# EAGLE schematic sdr_cutoff (EAGLE 9.4.2)
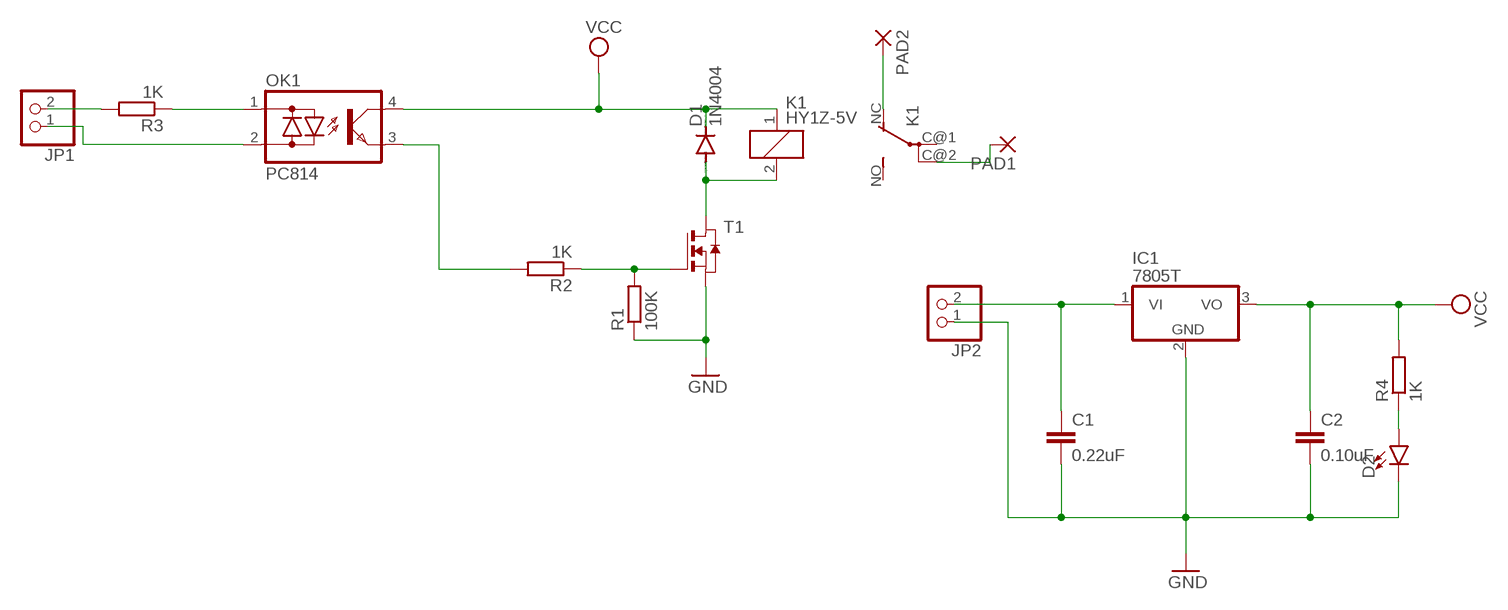
[diagram p0: schematic, sheet 1]

## Parts
C1  0.22uF  C-EU025-024X044  [C025-024X044]
C2  0.10uF  C-EU025-024X044  [C025-024X044]
D1  1N4004  [DO41-10]
D2  LED3MM  [LED_3MM]
IC1  7805T  [TO220H]
JP1  PINHD-1X2  [1X02]
JP2  PINHD-1X2  [1X02]
K1  HY1Z-5V  [HY]
OK1  PC814  [DIL04]
PAD1  2,54/0,8  [2,54/0,8]
PAD2  2,54/0,8  [2,54/0,8]
R1  100K  R-EU_0204/5  [0204/5]
R2  1K  R-EU_0204/5  [0204/5]
R3  1K  R-EU_0204/5  [0204/5]
R4  1K  R-EU_0204/5  [0204/5]
T1  NMOSE3L  [E3LINE]

## Nets
GND: C1.2 C2.2 D2.K(C) IC1.2(GND) JP2.1 R1.1 T1.3(S)
N$1: D1.A K1.2 T1.1(D)
N$2: OK1.3(E) R2.2
N$3: R1.2 R2.1 T1.2(G)
N$4: OK1.1(AC1) R3.1
N$5: JP1.1 OK1.2(AC2)
N$6: JP1.2 R3.2
N$8: C1.1 IC1.1(VI) JP2.2
N$9: K1.NC(2:O) PAD2.1(P)
N$10: D2.A R4.1
N$11: K1.C@2(2:P) PAD1.1(P)
VCC: C2.1 D1.C IC1.3(VO) K1.1 OK1.4(C) R4.2
Unconnected: K1.C@1(2:P) K1.NO(2:S)

## Library data of the parts
C1 C2 = rcl:C-EU: CAPACITOR, European symbol; SPICEPREFIX: C
D1 = diode:1N4004: DIODE general purpose rectifier, 1 A
D2 = SparkFun-LED:LED: LED (Generic) Standard schematic elements and footprints for 5mm, 3mm, 1206, and 0603 sized LEDs. Generic LEDs with no color specified.; PROD_ID: DIO-08794
IC1 = linear:78*: Positive VOLTAGE REGULATOR Source: http://cache.national.com/ds/LM/LM78L05.pdf http://www.fairchildsemi.com/ds/LM/LM7805.pdf
JP1 JP2 = pinhead:PINHD-1X2: PIN HEADER
K1 = relay:HY1*: Non-polarized 1 Form C Relay NAiS Source: http://www.mew-europe.com/.. en_ds_61012_0000.pdf; MF: AROMAT/ MATSUSHITA; MPN: HY1Z-5V; OC_FARNELL: unknown; OC_NEWARK: 52F9234
OK1 = optocoupler:PC814: SHARP OPTO COUPLER; OC_FARNELL: 9707662; OC_NEWARK: unknown
PAD1 PAD2 = wirepad:2,54/0,8: THROUGH-HOLE PAD
R1-R4 = rcl:R-EU_: RESISTOR, European symbol; SPICEPREFIX: R
T1 = zetex:NMOSE3L: MOS FET; OC_FARNELL: unknown; OC_NEWARK: unknown